# Altium project FPV0.2.1.PrjPCB
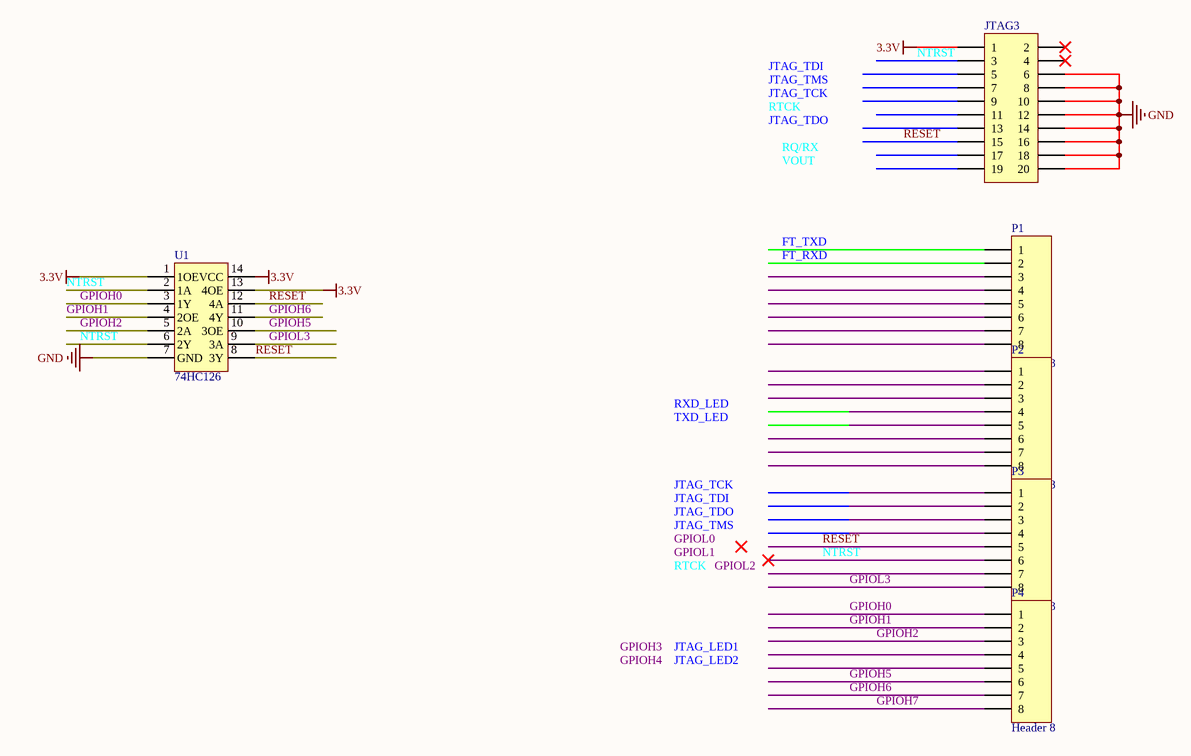
[diagram p0: FPV0.2.1.SchDoc]
1 sheet, 6 parts. Net scope: global (net labels, ports and power ports of the same name join across sheets).
Board file: FPV0.2.1.PcbDoc

## Sheet FPV0.2.1.SchDoc
size A4

### Parts
JTAG3  Header 10X2  [HDR2X10]  (value not drawn)
P1  Header 8  [HDR1X8]
P2  Header 8  [HDR1X8]
P3  Header 8  [HDR1X8]
P4  Header 8  [HDR1X8]
U1  74HC126  [SOP127P600-8N 74HC126]

### Nets
3.3V: JTAG3.1 U1.1(1OE) U1.13(4OE) U1.14(VCC)
GND: JTAG3.6 JTAG3.8 JTAG3.10 JTAG3.12 JTAG3.14 JTAG3.16 JTAG3.18 JTAG3.20 U1.7(GND)
FT_RXD: P1.2
FT_TXD: P1.1
GPIOH0: P4.1 U1.3(1Y)
GPIOH1: P4.2 U1.4(2OE)
GPIOH2: P4.3 U1.5(2A)
GPIOH5: P4.6 U1.10(3OE)
GPIOH6: P4.7 U1.11(4Y)
GPIOH7: P4.8
GPIOL3: P3.8 U1.9(3A)
NTRST: JTAG3.3 P3.6 U1.2(1A) U1.6(2Y)
RESET: JTAG3.15 P3.5 U1.8(3Y) U1.12(4A)

Not connected (* = marked no-connect by the designer): JTAG3 2* 4* 5 7 9 11 13 17 19; P1 3 4 5 6 7 8; P2 1 2 3 4 5 6 7 8; P3 1 2 3 4 7; P4 4 5

### Notes on the sheet
- Labels drawn without touching a wire or pin: GPIOH3, GPIOH4, GPIOL0, GPIOL1, GPIOL2, JTAG_LED1, JTAG_LED2, JTAG_TCK, JTAG_TDI, JTAG_TDO, JTAG_TMS, RQ/RX, RTCK, RXD_LED, TXD_LED, VOUT

### Library data of the parts
JTAG3 = Header 10X2: Header, 10-Pin, Dual row; LatestRevisionDate: 17-Jul-2002; LatestRevisionNote: Re-released for DXP Platform.; Publisher: Altium Limited
P1-P4 = Header 8: Header, 8-Pin; LatestRevisionDate: 17-Jul-2002; LatestRevisionNote: Re-released for DXP Platform.; Publisher: Altium Limited